# EAGLE design rolety (EAGLE 6.3)
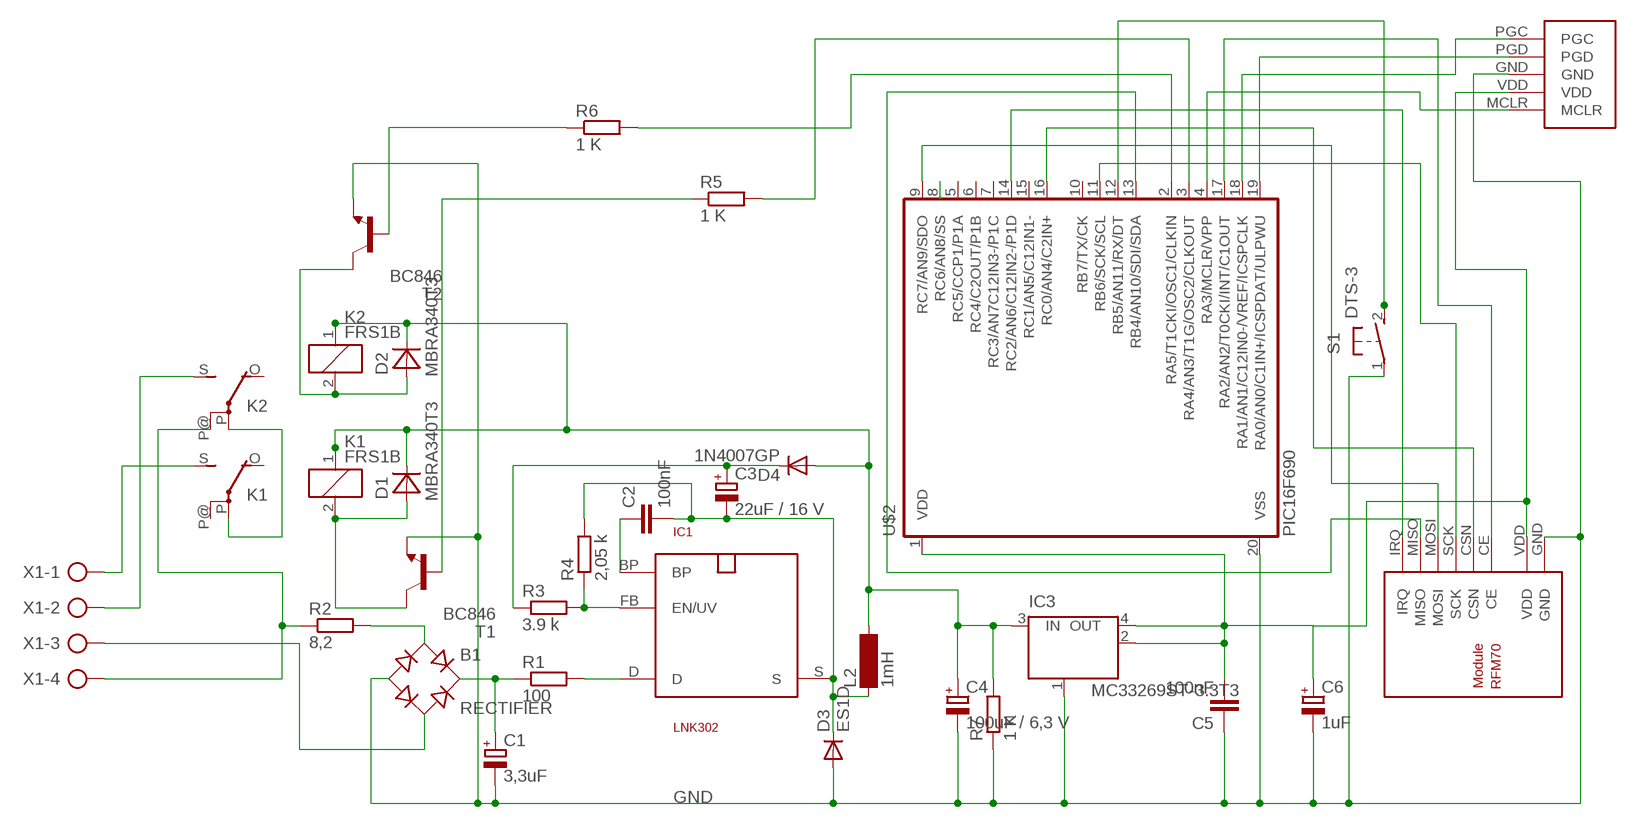
[diagram p0: schematic, sheet 1]

## Parts
B1  RECTIFIER  RECTIFIER-S40  [TO-269AA]
C1  3,3uF  CPOL-EUE5-10.5  [E5-10,5]
C2  100nF  C-EUC2012  [C2012]
C3  22uF / 16 V  CPOL-EUSMCC  [SMC_C]
C4  100uF / 6,3 V  CPOL-EUE2.5-5  [E2,5-5]
C5  100nF  C-EUC2012  [C2012]
C6  1uF  CPOL-EUSMCA  [SMC_A]
D1  MBRA340T3  [SMA]
D2  MBRA340T3  [SMA]
D3  ES1D  DIODE-DO214AC  [DO214AC]
D4  1N4007GP  DIODE-DO214AA  [DO214AA]
IC1  LNK302  SO-8C  [SO-8C]
IC3  MC33269ST-3.3T3  [SOT223]
K1  FRS1B  [FRS1B]
K2  FRS1B  [FRS1B]
L2  1mH  BS11  [BS11]
R1  100  R-EU_R2512W  [R2512W]
R2  8,2  R-EU_0411/12  [0411/12]
R3  3.9 k  R-EU_M2012  [M2012]
R4  2,05 k  R-EU_M2012  [M2012]
R5  1 K  R-EU_M2012  [M2012]
R6  1 K  R-EU_M2012  [M2012]
R7  1 K  R-EU_M2012  [M2012]
S1  DTS-3  [DTS-3]
T1  BC846  [SOT23]
T2  BC846  [SOT23]
U$1  RFM70  [RFM70]
U$2  PIC16F690  [SSOP20]
U$3  PROGRAMMINGHEADERDIP  [PROGHEADER]
X1  AK500/4  [AK500/4]

## Nets
GND: B1.- C1.- C4.- C5.1 C6.- D3.A IC3.1(GND/ADJ) R7.1 S1.1 T1.2(E) T2.2(E) U$1.GND U$2.20(VSS) U$3.GND
N$1: IC1.D R1.2
N$2: B1.+ C1.+ R1.1
N$3: B1.AC1 R2.2
N$4: B1.AC2 X1.3
N$5: S1.2 U$2.12(RB5/AN11/RX/DT)
N$6: R6.2 U$2.2(RA5/T1CKI/OSC1/CLKIN)
N$7: K1.S(2:S) X1.1
N$8: K2.S(2:S) X1.2
N$9: C3.+ D4.C R3.1
N$10: C2.1 IC1.BP
N$11: IC1.FB(EN/UV) R3.2 R4.1
N$12: U$1.MISO U$2.13(RB4/AN10/SDI/SDA)
N$13: C2.2 C3.- D3.C IC1.S L2.1 R4.2
N$14: D1.A K1.2 T1.3(C)
N$15: R5.1 T1.1(B)
N$16: U$1.CE U$2.17(RA2/AN2/T0CKI/INT/C1OUT)
N$17: C5.2 C6.+ IC3.2(OUT) IC3.4(OUT) U$1.VDD U$2.1(VDD) U$3.VDD
N$18: U$2.19(RA0/AN0/C1IN+/ICSPDAT/ULPWU) U$3.PGD
N$19: U$2.18(RA1/AN1/C12IN0-/VREF/ICSPCLK) U$3.PGC
N$20: U$1.CSN U$2.16(RC0/AN4/C2IN+)
N$21: U$1.IRQ U$2.14(RC2/AN6/C12IN2-/P1D)
N$22: U$1.SCK U$2.11(RB6/SCK/SCL)
N$23: U$1.MOSI U$2.9(RC7/AN9/SDO)
N$24: D2.A K2.2 T2.3(C)
N$25: U$2.4(RA3/MCLR/VPP) U$3.MCLR
N$26: K1.P(2:P) K2.P(2:P)
N$27: C4.+ D1.C D2.C D4.A IC3.3(IN) K1.1 K2.1 L2.2 R7.2
N$28: R6.1 T2.1(B)
N$29: U$2.8(RC6/AN8/SS)
N$35: R5.2 U$2.3(RA4/AN3/T1G/OSC2/CLKOUT)
N$36: K2.P@(2:P) R2.1 X1.4
Unconnected: K1.O(2:O) K1.P@(2:P) K2.O(2:O) U$2.5(RC5/CCP1/P1A) U$2.6(RC4/C2OUT/P1B) U$2.7(RC3/AN7C12IN3-/P1C) U$2.10(RB7/TX/CK) U$2.15(RC1/AN5/C12IN1-)

## Library data of the parts
B1 = rectifier:RECTIFIER-: Rectifier
C1 C3 C4 C6 = resistor:CPOL-EU: POLARIZED CAPACITOR, European symbol
C2 C5 = resistor:C-EU: CAPACITOR, European symbol
D1 D2 = diode:MBRA340T3: Surface Mount Schottky Power Rectifier Source: http://www.onsemi.com/pub_link/Collateral/MBRA340T3-D.PDF
D3 D4 = diode:DIODE-: DIODE
IC1 = powerint:SO-8C: 700V MOSFET für Schaltnetz-Trafos. Pin 3 fehlt. SMD
IC3 = linear:MC33269ST*: Adjustable Output Low Dropout Voltage Regulator 800 mA Source: http://www.onsemi.com/pub/Collateral/MC33269-D.PDF
K1 K2 = relay:FRS1B: RELAY 1 x switch, same as V23101-D6-A201, Siemens; OC_FARNELL: unknown; OC_NEWARK: unknown
L2 = inductor-neosid:BS: INDUCTOR nominal inductance, magnetically screened; OC_FARNELL: unknown; OC_NEWARK: unknown
R1-R7 = resistor:R-EU_: RESISTOR, European symbol
S1 = switch-tact:DTS-3
T1 T2 = transistor:BC846: NPN TRANSISTOR
U$1 = rfm70:RFM70: RFM70 2.4 Ghz Funkmodul Autor: Daniel Weber Website: http://projects.web4clans.com Email: daniel.weber@web4clans.com
U$2 = microchip:PIC16F690*: MICROCONTROLLER PIC16F690 18 I/O One 16-bit timer Two 8-bit timer Two comparators Precision internal oscillator-software selectable 8 MHz - 32 KHz SSP w/ I2C Compatible Address mask option EUSART LIN 2.0 Compatible ECCP+ w/ PWM Steering 12 A/D Channels ULPW Enhanced Low Power Timer 1 Timer 1 Gate Synch Latch 4k Program Flash memory 256 bytes SRAM 256 bytes EEPROM
U$3 = rfm70:PROGRAMMINGHEADER
X1 = con-ptr500:AK500/4: CONNECTOR; OC_FARNELL: unknown; OC_NEWARK: unknown

## Board
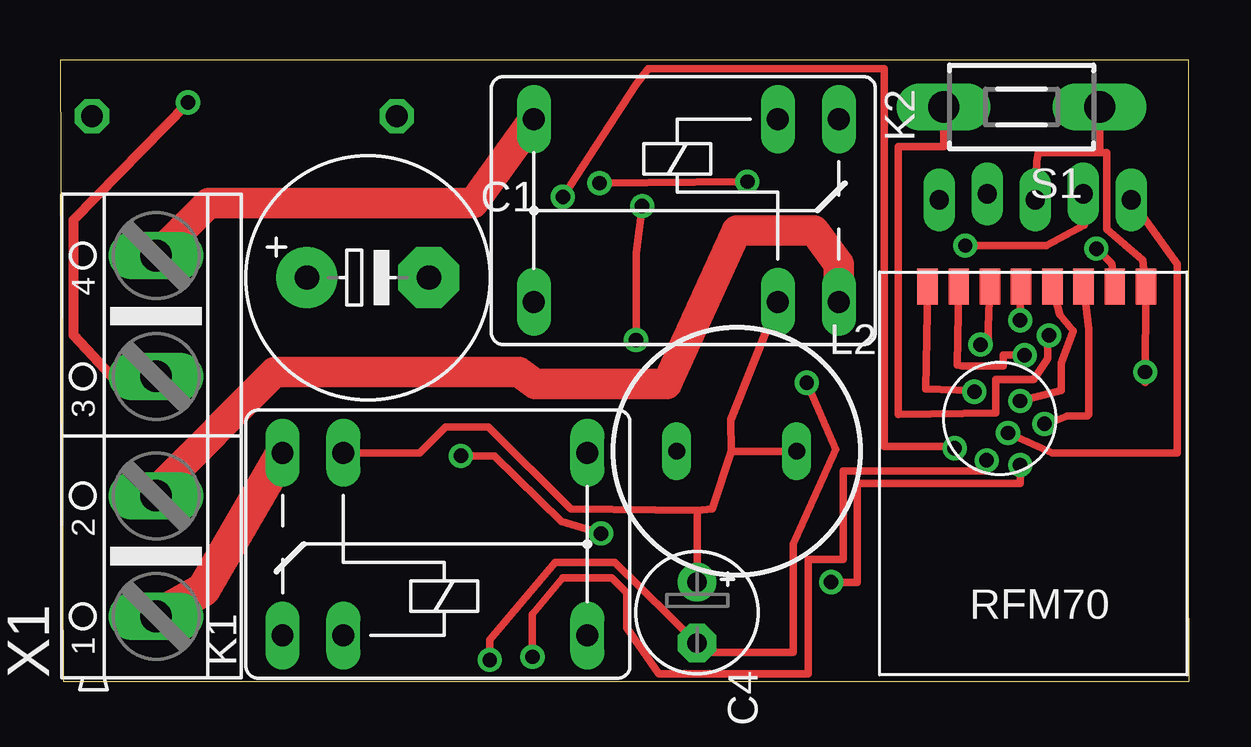
[diagram p1: board, top side]
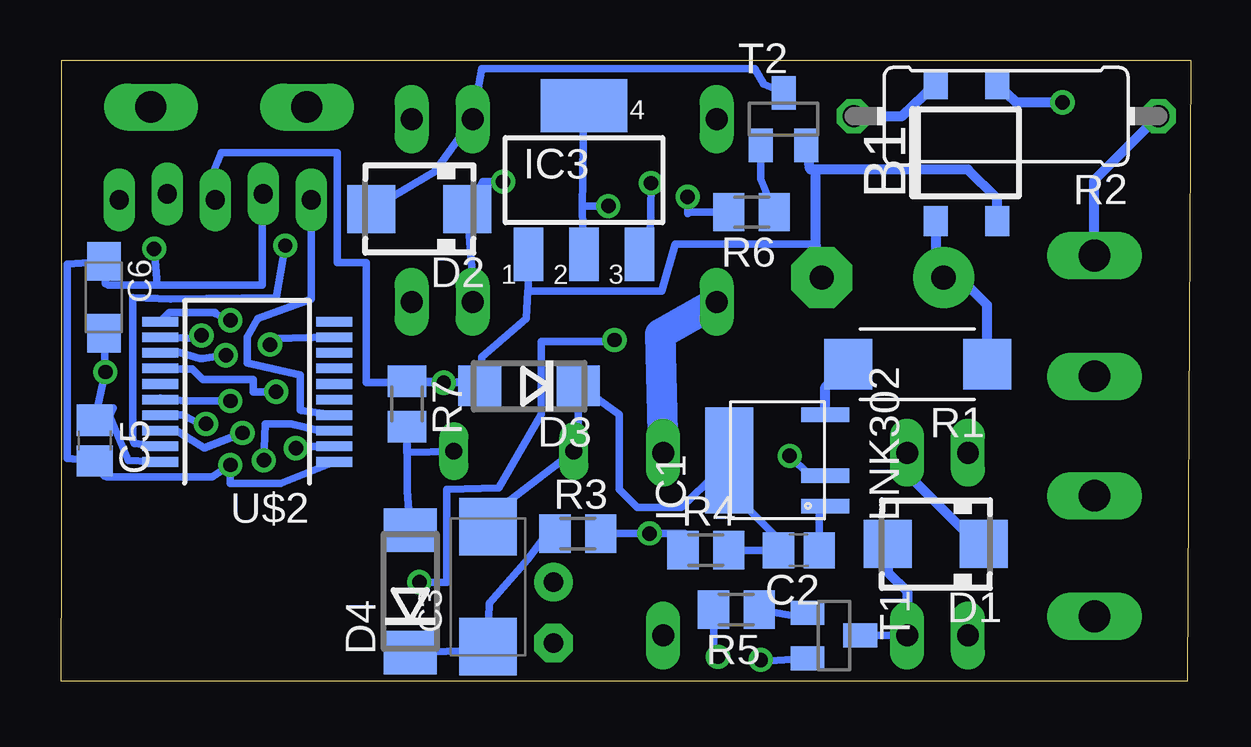
[diagram p2: board, bottom side, seen from below]

Size 47.05 x 25.9 mm. Coordinates in mm from the lower left corner, seen from the top.
Outline: 0.13,0 47.05,0 47.03,5.27 47.03,25.9 0,25.9 0.13,0
Copper layers (1*16): Top 0.035mm / dielectric 1.5mm / Bottom 0.035mm
Design rules "default": minimum track width 10mil, minimum drill 24mil, track to track 8mil, track to pad 8mil, pad to pad 8mil, via to via 8mil, smd to smd 8mil, copper to edge 40mil, drill to drill 8mil, minimum pad ring 10mil, minimum via ring 8mil, stop-mask expansion 4mil, vias tented up to drill 0mil, thermal gap 10mil

### Footprints (pad centres in the part's own frame; a part is rotated, then mirrored left to right if it is on the bottom)
TO-269AA = smd 1 x 1.25: + -1.28,-2.855; - 1.28,-2.855; AC1 -1.28,2.855; AC2 1.28,2.855
E5-10,5 = drill 1.016 pad 2.54: + -2.54,0 | drill 1.016 pad 2.54 octagon: - 2.54,0
C2012 = smd 1.3 x 1.5: 1 -0.85,0; 2 0.85,0
SMC_C = smd 2.4 x 2.4: + -2.5,0; - 2.5,0
E2,5-5 = drill 0.813 pad 1.6: + -1.27,0 | drill 0.813 pad 1.6 octagon: - 1.27,0
SMC_A = smd 1.6 x 1.4: + -1.5,0; - 1.5,0
SMA = smd 2 x 2: A 2,0; C -2,0
DO214AC = smd 1.8 x 1.7: A 2.05,0; C -2.05,0
DO214AA = smd 1.8 x 2.2: A 2.55,0; C -2.55,0
SO-8C = smd 0.6 x 2: BP -1.905,-2; D 1.905,-2; FB -0.635,-2 | smd 4.41 x 2: S 0,2
SOT223 = smd 1.219 x 2.235: 1 -2.311,-3.099; 2 0,-3.099; 3 2.311,-3.099 | smd 3.6 x 2.2: 4 0,3.099
FRS1B = drill 0.914 long: 1 0,3.81; 2 0,-3.81; O -2.54,-3.81; P 10.16,3.81; P@ 10.16,-3.81; S -2.54,3.81
BS11 = drill 0.7 long: 1 -2.5,0; 2 2.5,0
R2512W = smd 2 x 2.1: 1 -2.896,0; 2 2.896,0
0411/12 = drill 0.914 octagon: 1 -6.35,0; 2 6.35,0
M2012 = smd 1.3 x 1.6: 1 -0.95,0; 2 0.95,0
DTS-3 = drill 1.3 long: 1 -3.25,0; 2 3.25,0
SOT23 = smd 1 x 1.4: 1 -0.95,-1.1; 2 0.95,-1.1; 3 0,1.1
RFM70 = smd 0.85 x 1.5: CE 2.5,-14.3; CSN 3.8,-14.3; GND -0.1,-14.3; IRQ 9,-14.3; MISO 7.7,-14.3; MOSI 6.4,-14.3; SCK 5.1,-14.3; VDD 1.2,-14.3
SSOP20 = smd 0.4 x 1.5: 1 -2.925,-3.625; 2 -2.275,-3.625; 3 -1.625,-3.625; 4 -0.975,-3.625; 5 -0.325,-3.625; 6 0.325,-3.625; 7 0.975,-3.625; 8 1.625,-3.625; 9 2.275,-3.625; 10 2.925,-3.625; 11 2.925,3.625; 12 2.275,3.625; 13 1.625,3.625; 14 0.975,3.625; 15 0.325,3.625; 16 -0.325,3.625; 17 -0.975,3.625; 18 -1.625,3.625; 19 -2.275,3.625; 20 -2.925,3.625
PROGHEADER = drill 0.8 long: GND 0,0; MCLR -4,0; PGC 4,0; PGD 2,0.25; VDD -2,0.25
AK500/4 = drill 1.321 long: 1 -7.518,0; 2 -2.489,0; 3 2.489,0; 4 7.518,0

### Placement (x,y rotation side)
B1  9.33,22.03 0 bottom
C1  12.83,16.83 0 top
C2  16.32,5.46 180 bottom
C3  29.27,3.94 90 bottom
C4  26.54,2.86 270 top
C5  45.66,10.03 270 bottom
C6  45.28,16 270 bottom
D1  10.6,5.71 180 bottom
D2  32.13,19.68 180 bottom
D3  27.56,12.32 180 bottom
D4  32.51,3.75 90 bottom
IC1  17.21,9.21 90 bottom
IC3  25.27,20.89 0 bottom
K1  11.81,5.71 0 top
K2  29.91,19.62 180 top
L2  28.19,9.59 0 top
R1  11.37,13.21 180 bottom
R2  7.68,23.56 180 bottom
R3  25.53,6.16 0 bottom
R4  20.19,5.46 0 bottom
R5  18.92,2.98 180 bottom
R6  18.29,19.56 180 bottom
R7  32.64,11.56 270 bottom
S1  40.07,23.94 180 top
T1  14.86,1.91 270 bottom
T2  16.95,23.43 0 bottom
U$1  45.15,2.16 180 top
U$2  39.31,12.06 90 bottom
U$3  40.64,20.07 0 top
X1  4,10.22 90 top

### Tracks (layer width: path | path; a pad name or v marks a point on that pad's centre or on a via)
GND  (via drill 0.6)
  Top 0.305: v17.91,0.89 17.91,1.71 20.64,4.95 23.11,4.95 C4.- 26.8,1.21 30.54,1.21 30.54,5.71 32.32,9.65 v31.11,12.45 | 43.62,22.04 43.62,18.86 45.12,17.55 U$1.GND 45.21,12.46 v45.21,12.89 | 43.62,22.04 40.77,22.04 40.7,21.65 U$3.GND | 43.62,22.04 43.32,22.05 S1.1
  Bottom 0.305: T1.2 17.85,0.83 v17.91,0.89 | 29.27,12.45 D3.A 29.53,13.53 27.69,15.11 27.62,16.26 | IC3.1 27.58,16.28 27.62,16.26 | 27.62,16.26 22.04,16.26 21.46,18.22 15.62,18.22 | U$3.GND 40.7,20.07 40.7,21.27 40.39,22.04 35.56,22.04 35.56,17.46 34.35,17.46 34.35,12.45 v31.11,12.45 29.27,12.45 | C6.- v45.21,12.89 C5.1 44.89,11.39 45.02,11.05 44.26,9.2 U$2.20 | 29.27,12.45 29.02,12.45 R7.1
  Bottom 0.406: B1.- 8.05,20.12 9.27,21.34 15.62,21.34 | 15.62,21.34 15.83,21.34 T2.2 | C1.- 15.62,18.22 15.62,21.34
N$1
  Bottom 0.406: IC1.D 15.21,12.26 R1.2
N$2
  Bottom 0.406: B1.+ 10.62,17.83 | 10.62,17.83 C1.+ | R1.1 8.47,15.69 10.62,17.83
N$3
  Bottom 0.406: R2.2 12.01,23.56 B1.AC1
N$4  (via drill 0.6)
  Top 0.406: X1.3 2.15,12.71 0.57,14.41 0.57,19.24 v5.33,24.13
  Bottom 0.406: v5.33,24.13 7.23,24.13 B1.AC2
N$5  (via drill 0.6)
  Top 0.305: v41.21,14.41 41.15,14.1 41.15,13.46 40.58,12.57 38.99,12.57 38.99,11.18 34.93,11.11 34.93,22.29 36.82,22.29 S1.2
  Bottom 0.305: U$2.12 41.26,14.28 v41.21,14.41
N$6  (via drill 0.6)
  Top 0.305: v20.95,20.19 24,24.89 24.51,25.53 34.35,25.53 34.35,9.78 37.47,9.78 37.53,9.66 v37.28,9.72
  Bottom 0.305: U$2.2 37.45,9.79 v37.28,9.72 | R6.2 20.89,19.56 20.95,19.49 v20.95,20.19
N$7
  Top 1.422: K1.S 5.97,3.81 X1.1
N$8
  Top 1.27: X1.2 4,7.94 8.95,12.89 19.11,12.89 19.81,12.38 25.27,12.38 28.19,18.8 31.43,18.8 32.45,17.4 K2.S
N$9
  Bottom 0.305: D4.C 30.21,1.26 C3.+ 29.21,3.24 27.62,5.08 26.8,6.16 R3.1
N$10
  Bottom 0.305: C2.1 15.47,7.04 IC1.BP
N$11  (via drill 0.6)
  Top 0.305: v16.7,9.4 18.1,9.4 20.89,6.67 v22.54,6.16
  Bottom 0.305: IC1.FB 15.88,8.57 v16.7,9.4 | 21.46,6.03 R4.1 21.08,6.16 v22.54,6.16 22.99,6.16 23.3,6.16 R3.2
N$12  (via drill 0.6)
  Top 0.305: U$1.MISO 37.39,13.19 37.59,13.14 39.31,13.14 39.31,13.59 v40.2,13.59
  Bottom 0.305: v40.2,13.59 41.15,13.46 41.28,13.46 42.27,13.75 U$2.13
N$13
  Bottom 0.305: 19.24,9.18 18.8,7.56 16.83,5.59 C2.2 R4.2 | 19.24,9.18 IC1.S | C3.- 29.54,6.63 L2.1 25.5,10.28 D3.C 24.77,11.81 23.81,11.11 23.81,8 23.05,7.24 21.21,7.24 19.24,9.14 19.24,9.18
N$14
  Bottom 0.305: K1.2 T1.3
  Bottom 0.406: D1.A 12.61,4.54 11.81,3.75 K1.2
N$15
  Bottom 0.305: R5.1 16.15,2.67 T1.1
N$16  (via drill 0.6)
  Top 0.305: U$1.CE 42.86,14.68 42.86,11.11 42.8,11.05 41.97,11.05 41.15,10.73 v41.02,10.73
  Bottom 0.305: v41.02,10.73 41.28,10.73 41.91,11.05 41.95,11.09 U$2.17
N$17  (via drill 0.6)
  Top 0.305: U$1.VDD 43.82,17.41 v43.18,18.03 | v40.01,9.02 40.01,8.26 33.21,8.26 33.21,4.13 v32.13,4.13 | v24,14.22 24,17.84 v24.26,19.81
  Bottom 0.305: U$2.1 37.91,8.25 40.01,8.26 v40.01,9.02 40.77,8.51 45.15,8.51 45.25,8.55 C5.2 46.8,9.3 46.8,17.4 C6.+ 45.21,16.89 45.21,16.57 45.09,16.51 43.05,16.51 | 43.05,16.51 38.67,16.51 38.67,18.95 U$3.VDD | IC3.4 25.34,19.62 | 25.34,19.62 IC3.2 | v43.18,18.03 43.05,16.51 | v32.13,4.13 30.99,4.13 30.99,8 28.83,8.06 27.05,11.11 27.05,14.16 24.19,14.16 v24,14.22 | v24.26,19.81 25.34,19.81 25.34,19.62
N$18  (via drill 0.6)
  Top 0.305: v37.72,18.16 41.09,18.16 42.67,19.01 U$3.PGD
  Bottom 0.305: U$2.19 44.02,9.92 44.07,10.1 44.07,16 42.48,15.94 38.1,16 v37.72,18.16
N$19  (via drill 0.6)
  Top 0.305: U$3.PGC 46.55,17.4 46.55,12 46.55,9.53 41.34,9.53 v39.5,10.35
  Bottom 0.305: v39.5,10.35 41.09,9.72 42.21,10.41 U$2.18
N$20  (via drill 0.6)
  Top 0.305: U$1.CSN 41.67,15.29 42.23,14.61 41.72,13.27 41.72,12.13 v40.01,11.68
  Bottom 0.305: v40.01,11.68 41.91,11.68 42.92,11.81 U$2.16
N$21  (via drill 0.6)
  Top 0.305: v38.1,12.06 37.97,12.13 36.07,12.19 U$1.IRQ
  Bottom 0.305: v38.1,12.06 39.05,12.06 39.05,12.57 41.15,12.57 41.59,13.02 42.78,13.02 U$2.14
N$22  (via drill 0.6)
  Top 0.305: U$1.SCK 40.01,16.46 v40.01,15.05
  Bottom 0.305: v40.01,15.05 40.77,15.37 | 40.77,15.37 40.64,15.37 | 40.77,15.37 42.55,15.37 U$2.11
N$23  (via drill 0.6)
  Top 0.305: U$1.MOSI 38.69,14.74 38.67,14.03 v38.35,14.03
  Bottom 0.305: v38.35,14.03 38.3,14.29 U$2.9
N$24
  Bottom 0.305: T2.3 17.78,24.89 18.16,25.53 29.53,25.53 K2.2 31.5,21.24 D2.A
N$25
  Bottom 0.305: U$2.4 37.06,11.28 37.08,11.3 37.08,12.76 39.31,13.27 39.31,14.35 38.86,15.11 36.64,15.94 U$3.MCLR
N$26
  Bottom 1.27: K1.P 22.1,14.48 K2.P
N$27  (via drill 0.6)
  Top 0.305: K1.1 14.99,9.53 16.07,10.6 17.84,10.6 21.27,7.18 26.54,7.11 | 26.54,7.11 27.18,7.18 27.96,9.59 | 27.96,9.59 L2.2 | K2.1 27.94,10.9 27.96,9.59 | C4.+ 26.54,7.11 | v22.48,20.77 28.51,20.83 v28.64,20.83
  Bottom 0.305: K2.1 29.84,15.91 D2.C 29.5,20.83 v28.64,20.83 | L2.2 32.66,9.53 R7.2 32.64,7.94 D4.A | IC3.3 22.52,18.44 v22.48,20.77
  Bottom 0.406: D1.C 8.89,5.71 11.81,8.64 K1.1
N$28
  Bottom 0.305: R6.1 17.91,20.93 T2.1
N$35  (via drill 0.6)
  Top 0.305: v19.68,1.02 19.68,2.79 20.95,4.32 22.99,4.32 23.62,3.68 23.62,2.22 24.96,0.32 31.18,0.32 31.18,5.08 32.64,5.08 32.64,8.76 38.55,8.76 v38.61,9.21
  Bottom 0.305: R5.2 19.87,1.2 v19.68,1.02 | v38.61,9.21 38.55,10.73 37.47,10.73 36.42,10.48 U$2.3
N$36
  Top 1.27: K2.P@ 17.21,19.94 6.2,19.94 X1.4
  Bottom 0.406: X1.4 4,20.89 R2.1